# Altium schematic sheet 24V_to_3V3_regulator.SchDoc
size A4
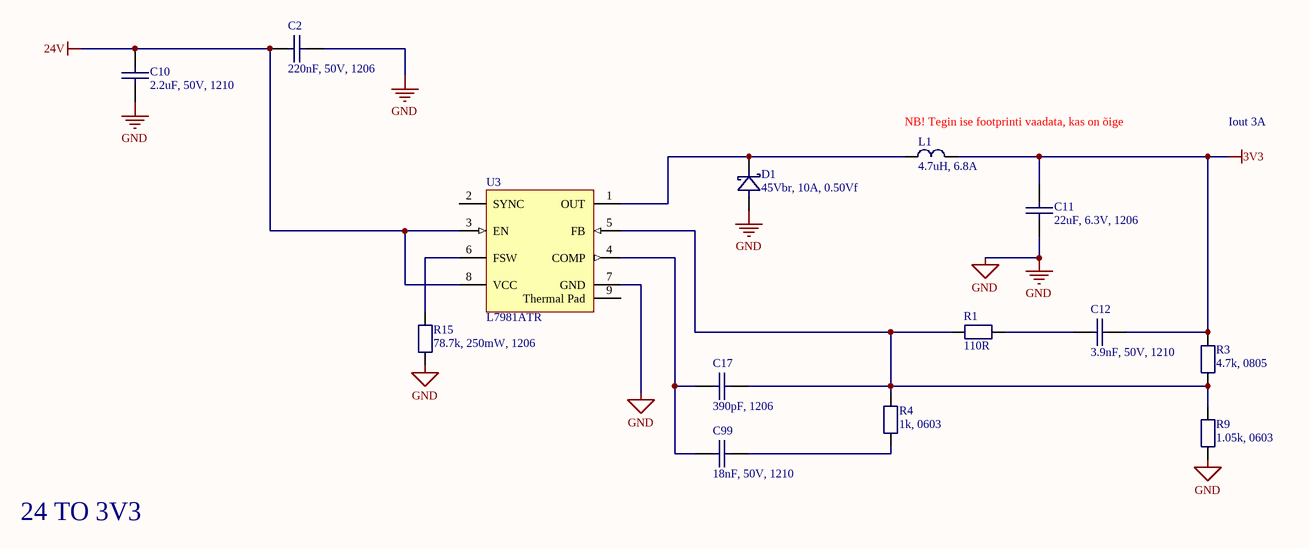
[diagram p0: 24V_to_3V3_regulator.SchDoc]

## Parts
C2  220nF, 50V, 1206  [3216 [1206] CAP]
C10  2.2uF, 50V, 1210  [3225 [1210] CAP]
C11  22uF, 6.3V, 1206  [3216 [1206] CAP]
C12  3.9nF, 50V, 1210  [3225 [1210] CAP]
C17  390pF, 1206  [3216 [1206] CAP]
C99  18nF, 50V, 1210  [2012 [0805] CAP]
D1  45Vbr, 10A, 0.50Vf  [DPAK (TO252-3)]
L1  4.7uH, 6.8A  [12.5 x 12.5 x 8.5 (mm)]
R1  110R  [2012 [0805] RES]
R3  4.7k, 0805  [2012 [0805] RES]
R4  1k, 0603  [1608 [0603] RES]
R9  1.05k, 0603  [1608 [0603] RES]
R15  78.7k, 250mW, 1206  [3216 [1206] RES]
U3  L7981ATR  [HSOP8-D1_N]

## Nets
3V3: C11.1 C12.1 L1.2 R3.2
24V: C2.2 C10.1 U3.3(EN) U3.8(VCC)
GND: C2.1 C10.2 C11.2 D1.2 R9.1 R15.1 U3.7(GND)
NetC12_2: C12.2 R1.2
NetC17_1: C17.1 R1.1 R3.1 R4.2 R9.2 U3.5(FB)
NetC17_2: C17.2 C99.2 U3.4(COMP)
NetC99_1: C99.1 R4.1
NetD1_1: D1.1 L1.1 U3.1(OUT)
NetR15_2: R15.2 U3.6(FSW)

Not connected (* = marked no-connect by the designer): U3 2(SYNC) 9(Thermal_Pad)

## Notes on the sheet
- (near L1) NB! Tegin ise footprinti vaadata, kas on õige
- Iout 3A
- 24 TO 3V3

## Library data of the parts
C2 = Capacitor: Product Name: CM316X7R224K50AT; Manufacturer: *; Supplier Number: 1216553; Supplier: Farnell; Notes: *
C10 = Capacitor: Product Name: CGA6M3X7R1H225K200AB; Manufacturer: *; Supplier Number: 2346972; Supplier: Farnell; Notes: *
C11 = Capacitor: Product Name: 12066C226KAT2A; Manufacturer: *; Supplier Number: 2526283; Supplier: Farnell; Notes: *
C12 = Capacitor: Product Name: 12105A392JAT2A; Manufacturer: *; Supplier Number: *; Supplier: Mouser; Notes: *
C17 = Capacitor: Product Name: 12065A391JAT2A; Manufacturer: *; Supplier Number: 2332871; Supplier: Farnell; Notes: *
C99 = Capacitor: Product Name: 12105C183KAT2A; Manufacturer: *; Supplier: Mouser; Notes: *
D1 = Diode Shottky: pin to pad: 1>2 2>3; Product Name: STPS1045B; Manufacturer: *; Supplier Number: 9907297; Supplier: Farnell; Notes: *
L1 = Inductor: Product Name: B82477G4472M000; Manufacturer: *; Supplier Number: 7430329; Supplier: Farnell; Notes: *
R1 R3 R4 R9 R15 = Resistor: Manufacturer: *; Product Name: *; Supplier Number: *; Supplier: Farnell; Notes: *
U3 = L7981ATR: 3 A step-down switching regulator, 8-Pin HSOP, Tape and Reel; DatasheetVersion: Jul-2010; PackageVersion: 2010; PackageReference: HSOP8-D1; PackageDescription: 8-Pin Small Outline Integrated Circuit 1.27 mm Pitch; ComponentLink1Description: Manufacturer URL; ComponentLink1URL: http://www.st.com; ComponentLink2Description: Datasheet; ComponentLink2URL: http://www.st.com/internet/com/TECHNICAL_RESOURCES/TECHNICAL_LITERATURE/DATASHEET/CD00217474.pdf